# EAGLE schematic i2s-shifter_rev2-non_plated (EAGLE 6.4)
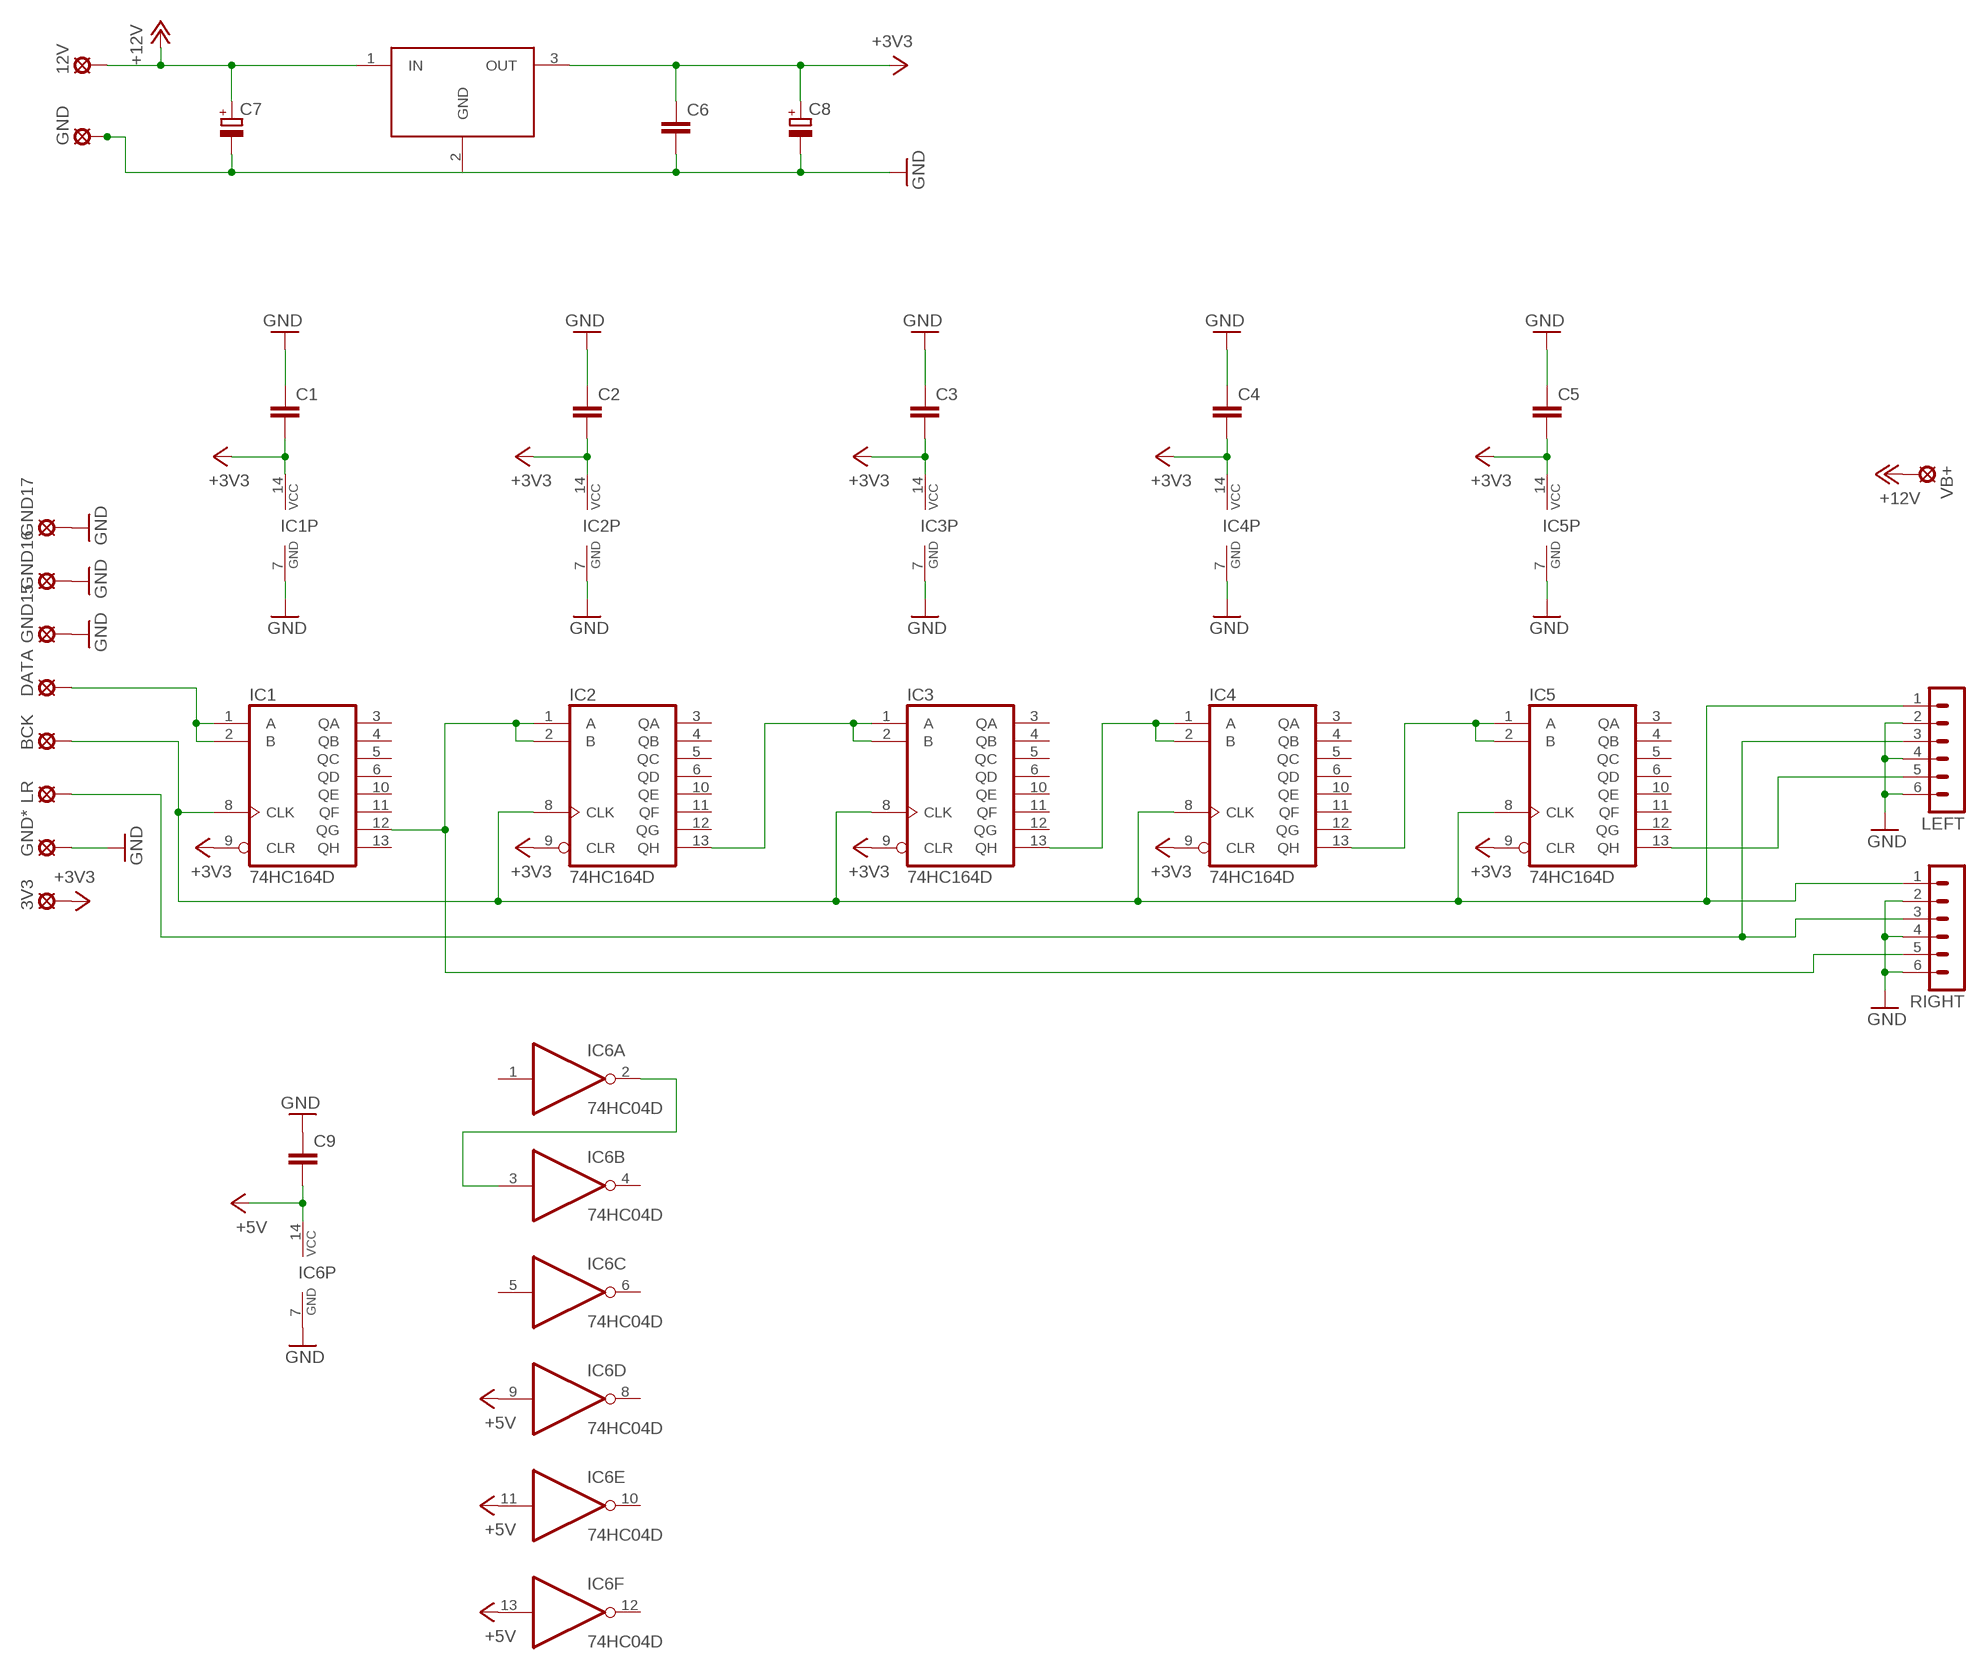
[diagram p0: schematic, sheet 1]

## Parts
3V3  LSP10  [LSP10]
12V  LSP10  [LSP10]
BCK  LSP10  [LSP10]
C1  C-EU050-025X075  [C050-025X075]
C2  C-EU050-025X075  [C050-025X075]
C3  C-EU050-025X075  [C050-025X075]
C4  C-EU050-025X075  [C050-025X075]
C5  C-EU050-025X075  [C050-025X075]
C6  C-EU050-025X075  [C050-025X075]
C7  CPOL-EUE7.5-16  [E7,5-16]
C8  CPOL-EUE5-10.5  [E5-10,5]
C9  C-EU050-025X075  [C050-025X075]
DATA  LSP10  [LSP10]
GND  LSP10  [LSP10]
GND15  LSP10  [LSP10]
GND16  LSP10  [LSP10]
GND17  LSP10  [LSP10]
GND*  LSP10  [LSP10]
IC1  74HC164D  [SO14]
IC2  74HC164D  [SO14]
IC3  74HC164D  [SO14]
IC4  74HC164D  [SO14]
IC5  74HC164D  [SO14]
IC6  74HC04D  [SO14]
IT1  LM3940IT-3.3  [TO220V]
LEFT  MA06-1  [MA06-1]
LR  LSP10  [LSP10]
RIGHT  MA06-1  [MA06-1]
VB+  LSP10  [LSP10]

## Nets
+3V3: 3V3.MP C1.2 C2.2 C3.2 C4.2 C5.2 C6.1 C8.+ IC1.9(CLR) IC1.14(VCC) IC2.9(CLR) IC2.14(VCC) IC3.9(CLR) IC3.14(VCC) IC4.9(CLR) IC4.14(VCC) IC5.9(CLR) IC5.14(VCC) IT1.3(OUT)
+5V: C9.2 IC6.9(D:I) IC6.11(E:I) IC6.13(F:I) IC6.14(P:VCC)
+12V: 12V.MP C7.+ IT1.1(IN) VB+.MP
GND: C1.1 C2.1 C3.1 C4.1 C5.1 C6.2 C7.- C8.- C9.1 GND15.MP GND16.MP GND17.MP GND*.MP GND.MP IC1.7(GND) IC2.7(GND) IC3.7(GND) IC4.7(GND) IC5.7(GND) IC6.7(P:GND) LEFT.2 LEFT.4 LEFT.6 RIGHT.2 RIGHT.4 RIGHT.6
N$1: DATA.MP IC1.1(A) IC1.2(B)
N$2: BCK.MP IC1.8(CLK) IC2.8(CLK) IC3.8(CLK) IC4.8(CLK) IC5.8(CLK) LEFT.1 RIGHT.1
N$3: IC1.12(QG) IC2.1(A) IC2.2(B) RIGHT.5
N$4: IC2.13(QH) IC3.1(A) IC3.2(B)
N$5: IC3.13(QH) IC4.1(A) IC4.2(B)
N$6: IC4.13(QH) IC5.1(A) IC5.2(B)
N$7: LEFT.3 LR.MP RIGHT.3
N$8: IC5.13(QH) LEFT.5
N$9: IC6.2(A:O) IC6.3(B:I)
Unconnected: IC1.3(QA) IC1.4(QB) IC1.5(QC) IC1.6(QD) IC1.10(QE) IC1.11(QF) IC1.13(QH) IC2.3(QA) IC2.4(QB) IC2.5(QC) IC2.6(QD) IC2.10(QE) IC2.11(QF) IC2.12(QG) IC3.3(QA) IC3.4(QB) IC3.5(QC) IC3.6(QD) IC3.10(QE) IC3.11(QF) IC3.12(QG) IC4.3(QA) IC4.4(QB) IC4.5(QC) IC4.6(QD) IC4.10(QE) IC4.11(QF) IC4.12(QG) IC5.3(QA) IC5.4(QB) IC5.5(QC) IC5.6(QD) IC5.10(QE) IC5.11(QF) IC5.12(QG) IC6.1(A:I) IC6.4(B:O) IC6.5(C:I) IC6.6(C:O) IC6.8(D:O) IC6.10(E:O) IC6.12(F:O)

## Power pins joined to a net without a drawn wire
GND: IT1.2(GND)

## Library data of the parts
3V3 12V BCK DATA GND GND15-GND17 GND* LR VB+ = solpad:LSP10: SOLDER PAD drill 1.0 mm, distributor Buerklin, 12H555
C1-C6 C9 = resistor:C-EU: CAPACITOR, European symbol
C7 C8 = resistor:CPOL-EU: POLARIZED CAPACITOR, European symbol
IC1-IC5 = 74xx-eu:74*164: 8-bit parallel out SHIFT REGISTER
IC6 = 74xx-eu:74*04: Hex INVERTER
IT1 = LM3940:LM3940IT-3.3: 1A Low Dropout Regulator for 5V to 3.3V Conversion
LEFT RIGHT = con-lstb:MA06-1: PIN HEADER; OC_FARNELL: unknown; OC_NEWARK: unknown